# EasyEDA Pro project ProProject_2024电赛备赛清单_Wang01_2024-08-05.epro, board PCB9比较器电路
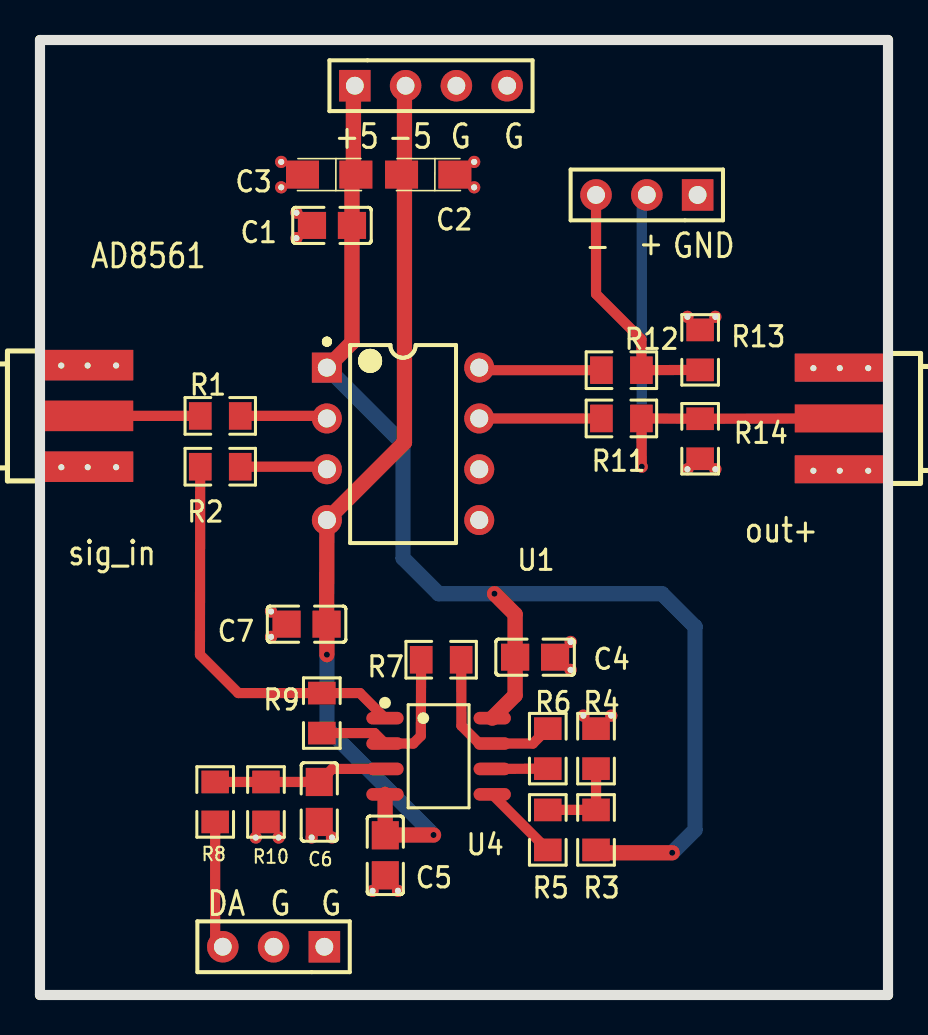
[diagram p10: board, top side]
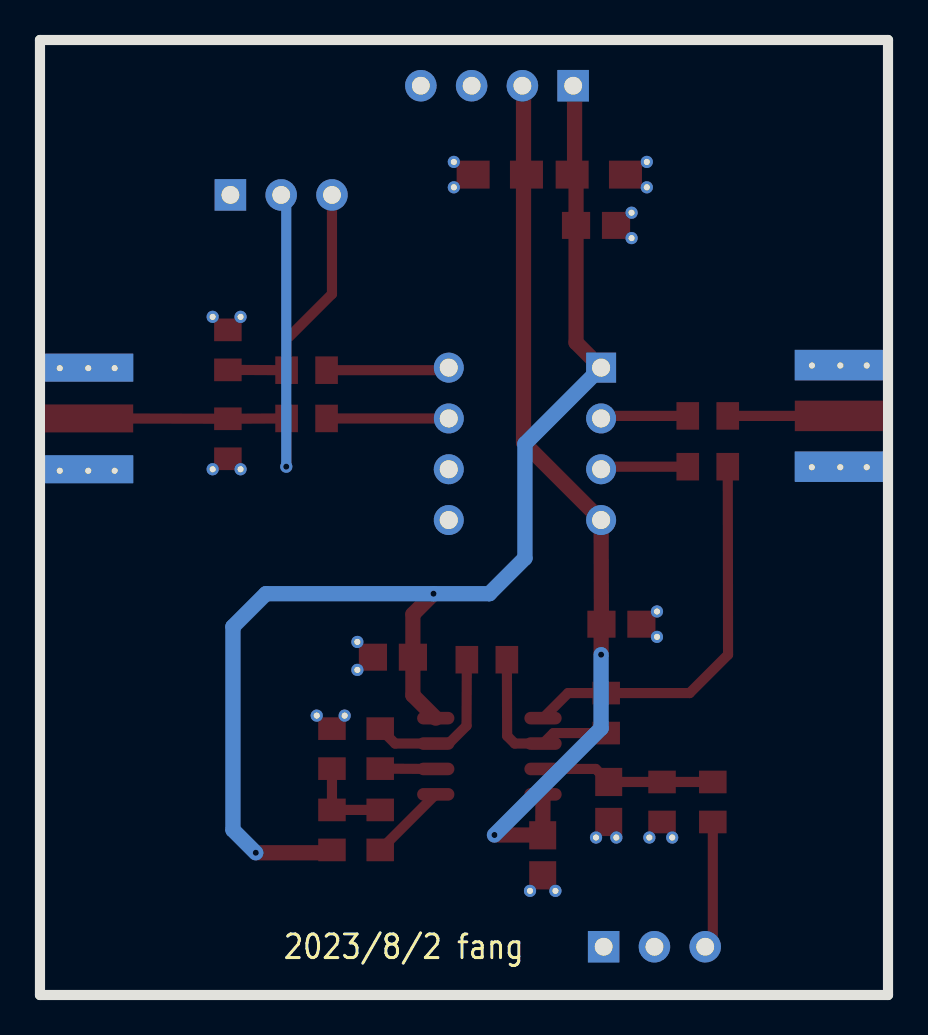
[diagram p11: board, bottom side, seen from below]

Outline 42.42 x 47.75 mm; copper layers: Top Layer, Bottom Layer. Coordinates in mm from the lower left corner of the outline.
Outline path: 0,47.75 42.42,47.75 42.42,0 0,0 0,47.75
Stack: Top Layer 0.035mm / Dielectric1 1.51mm FR4 er 4.5 / Bottom Layer 0.035mm

## Design rules (mm)
template: JLCPCB Capability(Two Layers Board)
spacing copperThickness1oz (default): track to track 0.102, other pairs 0.152 to 0.3
spacing copperThickness2oz: track to track 0.203, other pairs 0.152 to 0.3
track width copperThickness1oz (default): min 0.127, default 0.254, max 2.54
track width copperThickness2oz: min 0.203, default 0.254, max 2.54
differential pair differentialPair (default): width min 0.127, default 0.254, max 2.54; gap min 0.152, default 0.152
via viaSize (default): diameter min 0.5, default 0.61, max 10; hole min 0.3, default 0.305, max 6.3

## Placement (name value [footprint] x y rotation side)
C1  0.1u  [C0805]  14.61 38.48 0 top
C2  1u  [CASE-A_3216]  19.43 41.02 180 top
C3  1u  [CASE-A_3216]  14.48 41.02 180 top
C4  0.1u  [C0805]  24.77 16.89 180 top
C5  0.1u  [C0805]  17.27 6.98 90 top
C6  0.1u  [C0805]  13.97 9.65 90 top
C7  0.1u  [C0805]  13.34 18.54 0 top
J1  HDR-M-2.54_1x4  [HDR-M-2.54_1X4]  19.56 45.47 0 top
J2  HDR-M-2.54_1x3  [HDR-M-2.54_1X3]  11.68 2.41 180 top
J3  HDR-M-2.54_1x3  [HDR-M-2.54_1X3]  30.35 40.01 180 top
NOREF  -  [Pad_e97]  14.61 7.87 0 top
NOREF#2  -  [Pad_e75]  3.81 26.39 0 top
NOREF#3  -  [Pad_e32]  41.43 31.34 0 top
NOREF#4  -  [Pad_e12]  26.54 17.65 0 top
NOREF#5  -  [Pad_e53]  21.72 40.39 0 top
NOREF#6  -  [Pad_e54]  21.72 41.66 0 top
NOREF#7  -  [Pad_e159]  40.01 26.21 0 top
NOREF#8  -  [Pad_e30]  33.78 26.29 0 top
NOREF#9  -  [Pad_e71]  2.38 31.48 0 top
NOREF#10  -  [Pad_e29]  33.78 33.91 0 top
NOREF#11  -  [Pad_e156]  40.01 31.34 0 top
NOREF#12  -  [Pad_e81]  12.83 37.85 0 top
NOREF#13  -  [Pad_e136]  27.18 13.97 0 top
NOREF#14  -  [Pad_e63]  11.56 17.91 0 top
NOREF#15  -  [Pad_e13]  26.54 16.26 0 top
NOREF#16  -  [Pad_e56]  10.8 7.87 0 top
NOREF#17  -  [Pad_e109]  16.64 5.21 0 top
NOREF#18  -  [Pad_e70]  1.07 26.39 0 top
NOREF#19  -  [Pad_e82]  12.83 39.12 0 top
NOREF#20  -  [Pad_e21]  28.58 13.97 0 top
NOREF#21  -  [Pad_e64]  11.94 7.87 0 top
NOREF#22  -  [Pad_e65]  12.06 40.39 0 top
NOREF#23  -  [Pad_e61]  12.06 41.66 0 top
NOREF#24  -  [Pad_e83]  13.59 7.87 0 top
NOREF#25  -  [Pad_e146]  32.39 26.29 0 top
NOREF#26  -  [Pad_e69]  1.06 31.48 0 top
NOREF#27  -  [Pad_e31]  41.43 26.21 0 top
NOREF#28  -  [Pad_e147]  32.39 33.91 0 top
NOREF#29  -  [Pad_e154]  38.68 31.34 0 top
NOREF#30  -  [Pad_e10]  17.91 5.21 0 top
NOREF#31  -  [Pad_e153]  38.68 26.21 0 top
NOREF#32  -  [Pad_e72]  2.39 26.39 0 top
NOREF#33  -  [Pad_e74]  3.81 31.48 0 top
NOREF#34  -  [Pad_e62]  11.56 19.18 0 top
R1  1k  [R0805]  9.02 28.96 0 top
R2  1k  [R0805]  9.02 26.42 0 top
R3  3k  [R0805]  27.81 8.26 270 top
R4  1k  [R0805]  27.81 12.32 270 top
R5  1k  [R0805]  25.4 8.26 90 top
R6  1.2k  [R0805]  25.4 12.32 270 top
R7  1k  [R0805]  20.07 16.76 180 top
R8  1k  [R0805]  8.76 9.65 270 top
R9  1.2k  [R0805]  14.1 14.1 90 top
R10  1.2k  [R0805]  11.3 9.65 270 top
R11  1k  [R0805]  29.08 28.83 0 top
R12  1k  [R0805]  29.08 31.24 0 top
R13  1k  [R0805]  33.02 32.26 90 top
R14  1k  [R0805]  33.02 27.81 90 top
RF1  ZC8.8841KK  [SMA-SMD_ZC8.8841KK#2]  2.41 28.96 90 top
RF2  ZC8.8841KK  [SMA-SMD_ZC8.8841KK]  40.01 28.83 270 top
U1  AD8561ANZ  [DIP-8_L9.8-W6.6-P2.54-LS7.6-BL]  18.16 27.56 270 top
U4  NE5532M/TR  [SOP-8_L4.9-W3.9-P1.27-LS6.0-BL]  19.94 11.94 270 top

## Footprints (pads in the part's own frame, mm; a bottom-side part is the same pattern mirrored in y, then rotated)
C0805
  rect 1.41x1.35 smd: 1(-1,0) 2(1,0)
CASE-A_3216
  rect 1.651x1.397 smd: 1(-1.321,0) 2(1.346,0)
DIP-8_L9.8-W6.6-P2.54-LS7.6-BL
  rect 1.5x1.5 hole 0.9: 1(-3.81,-3.81)
  round 1.5 hole 0.9: 2(-1.27,-3.81) 3(1.27,-3.81) 4(3.81,-3.81) 5(3.81,3.81) 6(1.27,3.81) 7(-1.27,3.81) 8(-3.81,3.81)
HDR-M-2.54_1X3
  rect 1.575x1.575 hole 0.889: 1(-2.54,0)
  round 1.575 hole 0.889: 2(0,0) 3(2.54,0)
HDR-M-2.54_1X4
  rect 1.575x1.575 hole 0.889: 1(-3.81,0)
  round 1.575 hole 0.889: 2(-1.27,0) 3(1.27,0) 4(3.81,0)
Pad_e10
  round 0.61 hole 0.305: (0,0)
Pad_e12
  round 0.61 hole 0.305: (0,0)
Pad_e13
  round 0.61 hole 0.305: (0,0)
Pad_e21
  round 0.61 hole 0.305: (0,0)
Pad_e29
  round 0.61 hole 0.305: (0,0)
Pad_e30
  round 0.61 hole 0.305: (0,0)
Pad_e31
  round 0.61 hole 0.305: (0,0)
Pad_e32
  round 0.61 hole 0.305: (0,0)
Pad_e53
  round 0.61 hole 0.305: (0,0)
Pad_e54
  round 0.61 hole 0.305: (0,0)
Pad_e56
  round 0.61 hole 0.305: (0,0)
Pad_e61
  round 0.61 hole 0.305: (0,0)
Pad_e62
  round 0.61 hole 0.305: (0,0)
Pad_e63
  round 0.61 hole 0.305: (0,0)
Pad_e64
  round 0.61 hole 0.305: (0,0)
Pad_e65
  round 0.61 hole 0.305: (0,0)
Pad_e69
  round 0.61 hole 0.305: (0,0)
Pad_e70
  round 0.61 hole 0.305: (0,0)
Pad_e71
  round 0.61 hole 0.305: (0,0)
Pad_e72
  round 0.61 hole 0.305: (0,0)
Pad_e74
  round 0.61 hole 0.305: (0,0)
Pad_e75
  round 0.61 hole 0.305: (0,0)
Pad_e81
  round 0.61 hole 0.305: (0,0)
Pad_e82
  round 0.61 hole 0.305: (0,0)
Pad_e83
  round 0.61 hole 0.305: (0,0)
Pad_e97
  round 0.61 hole 0.305: (0,0)
Pad_e109
  round 0.61 hole 0.305: (0,0)
Pad_e136
  round 0.61 hole 0.305: (0,0)
Pad_e146
  round 0.61 hole 0.305: (0,0)
Pad_e147
  round 0.61 hole 0.305: (0,0)
Pad_e153
  round 0.61 hole 0.305: (0,0)
Pad_e154
  round 0.61 hole 0.305: (0,0)
Pad_e156
  round 0.61 hole 0.305: (0,0)
Pad_e159
  round 0.61 hole 0.305: (0,0)
R0805
  rect 1.133x1.377 smd: 1(-1,0) 2(1,0)
SMA-SMD_ZC8.8841KK
  rect 1.397x4.5 smd: 1(0,0) 2(-2.54,0) 3(2.54,0)
  rect 1.397x4.5 smd far side: 4(-2.54,0) 5(2.54,0)
SMA-SMD_ZC8.8841KK#2
  rect 1.524x4.5 smd: 1(0,0) 2(-2.54,0) 3(2.54,0)
  rect 1.524x4.5 smd far side: 4(-2.54,0) 5(2.54,0)
SOP-8_L4.9-W3.9-P1.27-LS6.0-BL
  oval 0.63x1.865 smd: 1(-1.905,-2.683) 2(-0.635,-2.683) 3(0.635,-2.683) 4(1.905,-2.683) 5(1.905,2.683) 6(0.635,2.683) 7(-0.635,2.683) 8(-1.905,2.683)

## Nets
1.25V: R3.1 R4.2 R5.2
+5V: C1.2 C3.1 C4.2 J1.1 R3.2 U1.1 U4.8
-5V: C2.2 C5.2 C7.2 J1.2 U1.4 U4.4
GND: C1.1 C2.1 C3.2 C4.1 C5.1 C6.1 C7.1 J1.3 J1.4 J2.1 J2.2 J3.1 NOREF. NOREF#2. NOREF#3. NOREF#4. NOREF#5. NOREF#6. NOREF#7. NOREF#8. NOREF#9. NOREF#10. NOREF#11. NOREF#12. NOREF#13. NOREF#14. NOREF#15. NOREF#16. NOREF#17. NOREF#18. NOREF#19. NOREF#20. NOREF#21. NOREF#22. NOREF#23. NOREF#24. NOREF#25. NOREF#26. NOREF#27. NOREF#28. NOREF#29. NOREF#30. NOREF#31. NOREF#32. NOREF#33. NOREF#34. R4.1 R10.2 R13.2 R14.1 RF1.2 RF1.3 RF1.4 RF1.5 RF2.2 RF2.3 RF2.4 RF2.5 U1.5 U1.6
-OUT: J3.3 R12.2 R13.1
COM: R2.1 R9.2 U4.1
DA: J2.3 R8.2
OFFSET: R6.1 R7.1 U4.7
OUT: J3.2 R11.2 R14.2 RF2.1
SIG: R1.1 RF1.1
U1_2: R1.2 U1.2
U1_3: R2.2 U1.3
U1_7: R11.1 U1.7
U1_8: R12.1 U1.8
U4_2: R7.2 R9.1 U4.2
U4_3: C6.2 R8.1 R10.1 U4.3
U4_5: R5.1 U4.5
U4_6: R6.2 U4.6

## Via types
v1: diameter 0.61, hole 0.305, Top Layer to Bottom Layer, 5 vias

## Routing (per net, layer and track width the routed paths; a pad name or vN(x,y) marks a point on that pad's centre or on a via; arc(x,y) is an arc through that point)
1.25V: length 4.5
  Top Layer w0.508: R5.2 R3.1 R4.2
+5V: length 64.6
  Top Layer w0.762: J1.1 15.68,45.4 15.68,41.02 15.61,40.95 C1.2 15.61,32.62 U1.1 ; v1(22.73,20.07) 23.77,19.03 C4.2 23.77,14.99 U4.8 ; v1(31.62,7.11) 27.96,7.11 R3.2
  Bottom Layer w0.762: v1(31.62,7.11) 32.77,8.26 32.77,18.42 31.12,20.07 v1(22.73,20.07) 19.94,20.07 18.16,21.84 18.16,27.56 U1.1
-5V: length 45.8
  Top Layer w0.762: v1(19.69,8) 17.29,8 C5.2 U4.4 ; v1(14.35,17.02) 14.35,18.53 C7.2 U1.4 18.23,27.63 18.23,45.41 J1.2
  Bottom Layer w0.762: v1(14.35,17.02) 14.35,13.34 v1(19.69,8)
-OUT: length 12.6
  Top Layer w0.508: R13.1 R12.2 30.08,32.78 27.81,35.05 J3.3
COM: length 20
  Top Layer w0.508: 8.02,26.42 8,17.02 9.92,15.1 R9.2 16,15.1 U4.1
DA: length 6.4
  Top Layer w0.508: R8.2 8.76,2.79 J2.3
OFFSET: length 8.3
  Top Layer w0.508: R7.1 21.08,13.46 21.97,12.57 U4.7 24.65,12.57 R6.1
OUT: length 26
  Top Layer w0.508: v1(30.1,26.42) R11.2 R14.2 RF2.1
  Bottom Layer w0.508: J3.2 30.1,39.75 v1(30.1,26.42)
SIG: length 5.6
  Top Layer w0.508: RF1.1 R1.1
U1_2: length 4.4
  Top Layer w0.508: R1.2 14.22,28.96 U1.2
U1_3: length 4.4
  Top Layer w0.508: U1.3 14.22,26.42 R2.2
U1_7: length 6.1
  Top Layer w0.508: U1.7 R11.1
U1_8: length 6.2
  Top Layer w0.508: R12.1 22.1,31.24 U1.8
U4_2: length 9.1
  Top Layer w0.508: R9.1 16.73,13.1 U4.2 18.67,12.57 19.05,12.95 19.06,16.76
U4_3: length 8.8
  Top Layer w0.508: U4.3 14.62,11.3 C6.2 R10.1 R8.1
U4_5: length 3.9
  Top Layer w0.508: U4.5 R5.1
U4_6: length 2.8
  Top Layer w0.508: R6.2 U4.6

## Copper pours and planes (outline as drawn; the poured copper is in the pictures)
GND on Top Layer: -2.92,51.18 -2.67,51.44 49.4,51.44 46.36,48.39 46.36,-6.98 -3.68,-6.98
GND on Bottom Layer: -4.19,51.69 47.37,51.69 45.85,50.17 45.85,-8.51 44.32,-10.03 -2.41,-10.03

## Text on the board
Bottom Silkscreen Layer: 2023/8/2 fang
Top Silkscreen Layer: G | - | + | sig_in | AD8561 | DA | +5 | -5 | GND | out+
